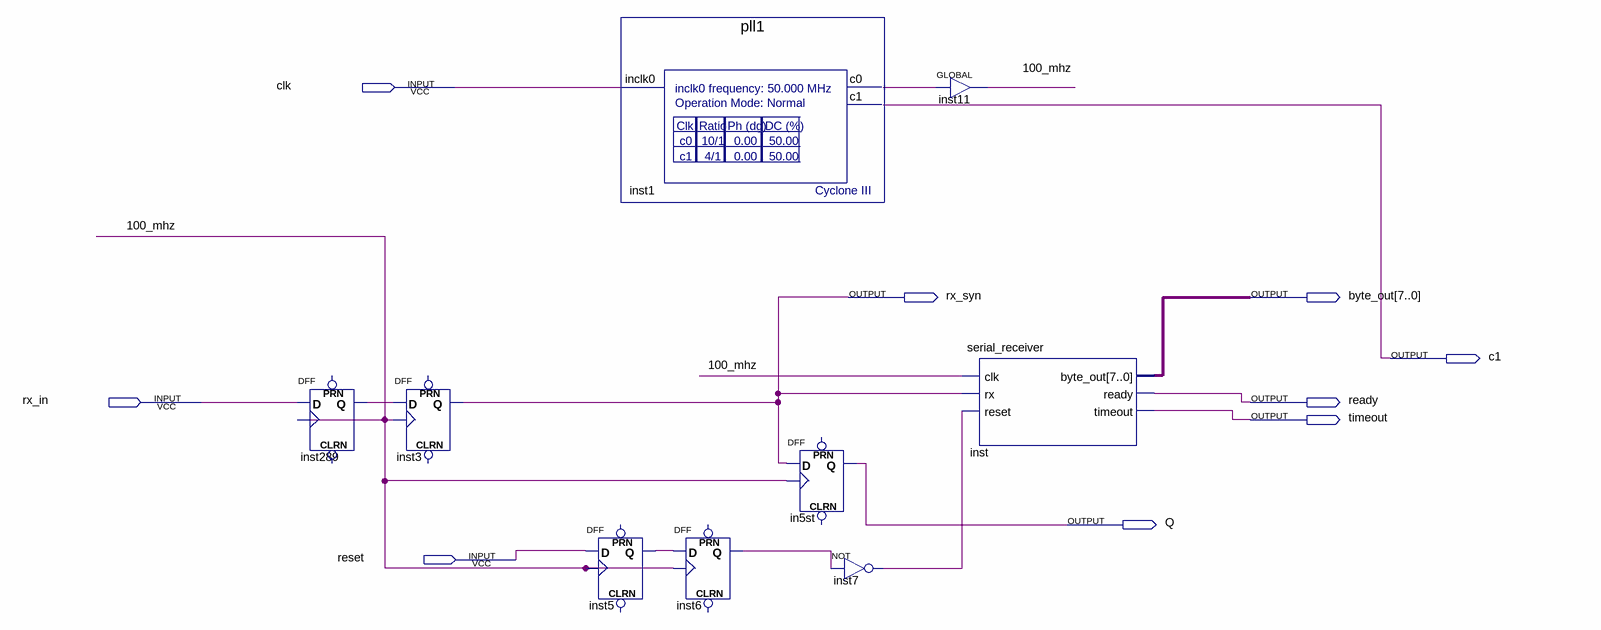
[diagram p0: schematic sheet]
// Quartus schematic slave_serial.bdf as structural Verilog: 9 symbols, 9 pins
module slave_serial (
  input  clk,
  input  rx_in,
  input  reset,
  output rx_syn,
  output [7:0] byte_out,
  output c1,
  output ready,
  output timeout,
  output Q
);

  wire \100_mhz , inst1_c0, inst5_q, inst6_q, inst7_out, inst289_q;

  DFF inst289 (.CLK(\100_mhz ), .D(rx_in), .Q(inst289_q));  // open: CLRN, PRN
  DFF inst3 (.CLK(\100_mhz ), .D(inst289_q), .Q(rx_syn));  // open: CLRN, PRN
  pll1 inst1 (.inclk0(clk), .c0(inst1_c0), .c1(c1));
  DFF inst5 (.CLK(\100_mhz ), .D(reset), .Q(inst5_q));  // open: CLRN, PRN
  DFF inst6 (.CLK(\100_mhz ), .D(inst5_q), .Q(inst6_q));  // open: CLRN, PRN
  DFF in5st (.CLK(\100_mhz ), .D(rx_syn), .Q(Q));  // open: CLRN, PRN
  not inst7 (inst7_out, inst6_q);
  GLOBAL inst11 (.IN(inst1_c0), .OUT(\100_mhz ));
  serial_receiver inst (
    .clk(\100_mhz ), .rx(rx_syn), .reset(inst7_out), .byte_out(byte_out), .ready(ready), .timeout(timeout));
endmodule
